# Altium schematic sheet keyboard.SchDoc
size A3
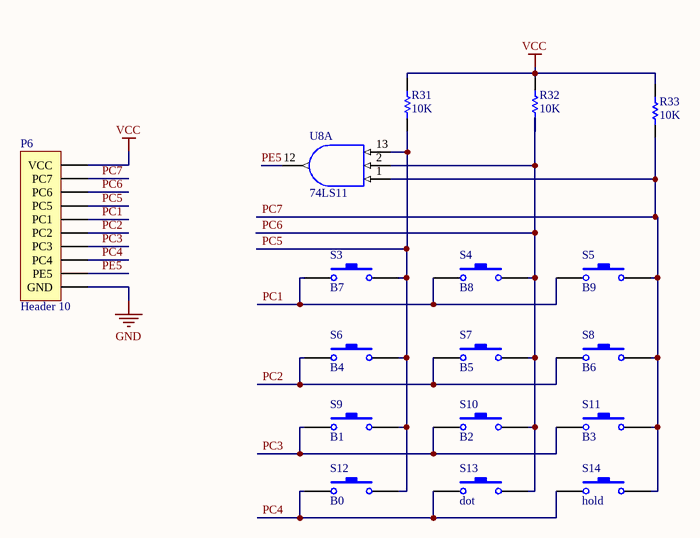
[diagram p0: keyboard.SchDoc]

## Parts
P6  Header 10  [HDR1X10]
R31  value 10K  [6-0805_N]  (hidden comment: Res1)
R32  value 10K  [6-0805_N]  (hidden comment: Res1)
R33  value 10K  [6-0805_N]  (hidden comment: Res1)
S3  B7  [buttin12*12]
S4  B8  [buttin12*12]
S5  B9  [buttin12*12]
S6  B4  [buttin12*12]
S7  B5  [buttin12*12]
S8  B6  [buttin12*12]
S9  B1  [buttin12*12]
S10  B2  [buttin12*12]
S11  B3  [buttin12*12]
S12  B0  [buttin12*12]
S13  dot  [buttin12*12]
S14  hold  [buttin12*12]
U8  74LS11  [PRSP0014DF-B_N]  (part A of 3)

## Nets
GND: P6.10(GND)
VCC: P6.1(VCC) R31.2 R32.2 R33.1
PC1: P6.5(PC1) S3.1 S4.1 S5.1
PC2: P6.6(PC2) S6.1 S7.1 S8.1
PC3: P6.7(PC3) S9.1 S10.1 S11.1
PC4: P6.8(PC4) S12.1 S13.1 S14.1
PC5: P6.4(PC5) R31.1 S3.2 S6.2 S9.2 S12.2 U8.13(1C)
PC6: P6.3(PC6) R32.1 S4.2 S7.2 S10.2 S13.2 U8.2(1B)
PC7: P6.2(PC7) R33.2 S5.2 S8.2 S11.2 S14.2 U8.1(1A)
PE5: P6.9(PE5) U8.12(1Y)

Not connected (* = marked no-connect by the designer): U8 7(GND) 14(VCC)

## Library data of the parts
P6 = Header 10: Header, 10-Pin; LatestRevisionDate: 17-Jul-2002; LatestRevisionNote: Re-released for DXP Platform.; Publisher: Altium Limited
R31-R33 = Res1: Resistor; Published: 8-Jun-2000; LatestRevisionDate: 17-Jul-2002; LatestRevisionNote: Re-released for DXP Platform.; PackageReference: AXIAL-0.3; Publisher: Altium Limited; PackageDescription: Axial Device, Thru-Hole; 2 Leads; 0.3 in Pin Spacing
S3-S14 = SW-PB: Switch; Published: 24-Mar-1999; LatestRevisionDate: 17-Jul-2002; LatestRevisionNote: Re-released for DXP Platform.; PackageReference: SPST-2; Publisher: Altium Limited; PackageDescription: Switch; 2 Leads
U8 = HD74LS11P: Triple 3-Input AND Gates; Published: 10-Feb-2010; DatasheetVersion: Rev.3.00, Jul-2005; PackageVersion: Sep-2005; PackageReference: PRDP0014AB-B; Publisher: Altium Limited; PackageDescription: 14-Pin Plastic DIP, 19.2 x 6.3 mm Body, 7.62 mm Row Spacing, Pitch 2.54 mm; Code_JEITA: P-DIP14-6.3x19.2-2.54; ComponentLink1Description: Manufacturer Link; ComponentLink1URL: http://sg.renesas.com/fmwk.jsp?cnt=hd74ls_root.jsp&fp=/products/standard_ic/general_purpose_logic/5v_standard_logic/hd74ls/; ComponentLink2Description: Datasheet; ComponentLink2URL: http://documentation.renesas.com/eng/products/logic/rej03d0397_hd74ls11.pdf; ComponentLink3Description: Packaging Specification; ComponentLink3URL: http://sg.renesas.com/media/products/common_info/package/pdf/ic/code/prdp0014ab_b.pdf